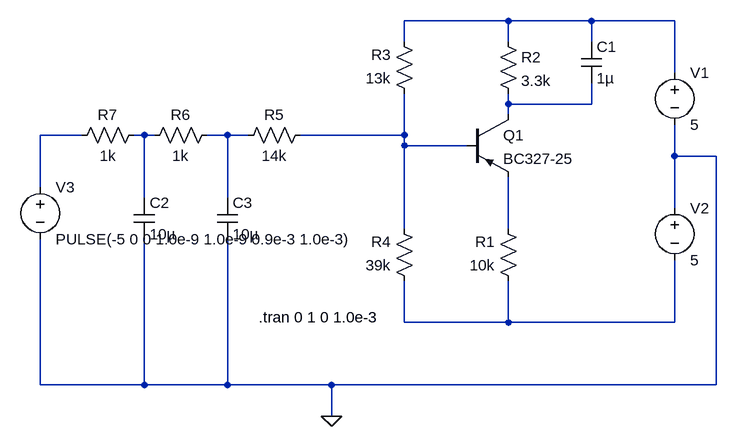
[diagram p0: schematic DCshiftingapplication.asc]
DCshiftingapplication.asc, the LTspice schematic file:
Version 4
SHEET 1 880 680
WIRE 352 0 192 0
WIRE 480 0 352 0
WIRE 608 0 480 0
WIRE 192 32 192 0
WIRE 352 32 352 0
WIRE 480 32 480 0
WIRE 608 80 608 0
WIRE 352 128 352 112
WIRE 480 128 480 96
WIRE 480 128 352 128
WIRE 352 144 352 128
WIRE -304 176 -368 176
WIRE -208 176 -224 176
WIRE -192 176 -208 176
WIRE -80 176 -112 176
WIRE -48 176 -80 176
WIRE 192 176 192 112
WIRE 192 176 32 176
WIRE 192 192 192 176
WIRE 288 192 192 192
WIRE 608 208 608 160
WIRE 672 208 608 208
WIRE -368 256 -368 176
WIRE -208 272 -208 176
WIRE -80 272 -80 176
WIRE 608 288 608 208
WIRE 192 320 192 192
WIRE 352 320 352 240
WIRE 192 464 192 400
WIRE 352 464 352 400
WIRE 352 464 192 464
WIRE 608 464 608 368
WIRE 608 464 352 464
WIRE -368 560 -368 336
WIRE -208 560 -208 336
WIRE -208 560 -368 560
WIRE -80 560 -80 336
WIRE -80 560 -208 560
WIRE 80 560 -80 560
WIRE 672 560 672 208
WIRE 672 560 80 560
WIRE 80 608 80 560
FLAG 80 608 0
SYMBOL res 48 160 R90
WINDOW 0 0 56 VBottom 2
WINDOW 3 32 56 VTop 2
SYMATTR InstName R5
SYMATTR Value 14k
SYMBOL res 208 128 R180
WINDOW 0 36 76 Left 2
WINDOW 3 36 40 Left 2
SYMATTR InstName R3
SYMATTR Value 13k
SYMBOL res 208 416 R180
WINDOW 0 36 76 Left 2
WINDOW 3 36 40 Left 2
SYMATTR InstName R4
SYMATTR Value 39k
SYMBOL res 368 416 R180
WINDOW 0 36 76 Left 2
WINDOW 3 36 40 Left 2
SYMATTR InstName R1
SYMATTR Value 10k
SYMBOL pnp 288 144 R0
SYMATTR InstName Q1
SYMATTR Value BC327-25
SYMBOL res 336 16 R0
SYMATTR InstName R2
SYMATTR Value 3.3k
SYMBOL cap 464 32 R0
SYMATTR InstName C1
SYMATTR Value 1µ
SYMBOL voltage 608 64 R0
SYMATTR InstName V1
SYMATTR Value 5
SYMBOL voltage 608 272 R0
SYMATTR InstName V2
SYMATTR Value 5
SYMBOL res -96 160 R90
WINDOW 0 0 56 VBottom 2
WINDOW 3 32 56 VTop 2
SYMATTR InstName R6
SYMATTR Value 1k
SYMBOL res -208 160 R90
WINDOW 0 0 56 VBottom 2
WINDOW 3 32 56 VTop 2
SYMATTR InstName R7
SYMATTR Value 1k
SYMBOL cap -224 272 R0
SYMATTR InstName C2
SYMATTR Value 10µ
SYMBOL cap -96 272 R0
SYMATTR InstName C3
SYMATTR Value 10µ
SYMBOL voltage -368 240 R0
SYMATTR InstName V3
SYMATTR Value PULSE(-5 0 0 1.0e-9 1.0e-9 0.9e-3 1.0e-3)
TEXT -32 456 Left 2 !.tran 0 1 0 1.0e-3

The netlist it stands for:
* DCshiftingapplication.asc
R5 N006 N005 14k
R3 N006 N001 13k
R4 N008 N006 39k
R1 N008 N007 10k
Q1 N002 N006 N007 0 BC327-25
R2 N001 N002 3.3k
C1 N001 N002 1µ
V1 N001 0 5
V2 0 N008 5
R6 N005 N004 1k
R7 N004 N003 1k
C2 N004 0 10µ
C3 N005 0 10µ
V3 N003 0 PULSE(-5 0 0 1.0e-9 1.0e-9 0.9e-3 1.0e-3)
.model NPN NPN
.model PNP PNP
.lib standard.bjt
.tran 0 1 0 1.0e-3
.backanno
.end